# EAGLE design final (EAGLE 6.1)
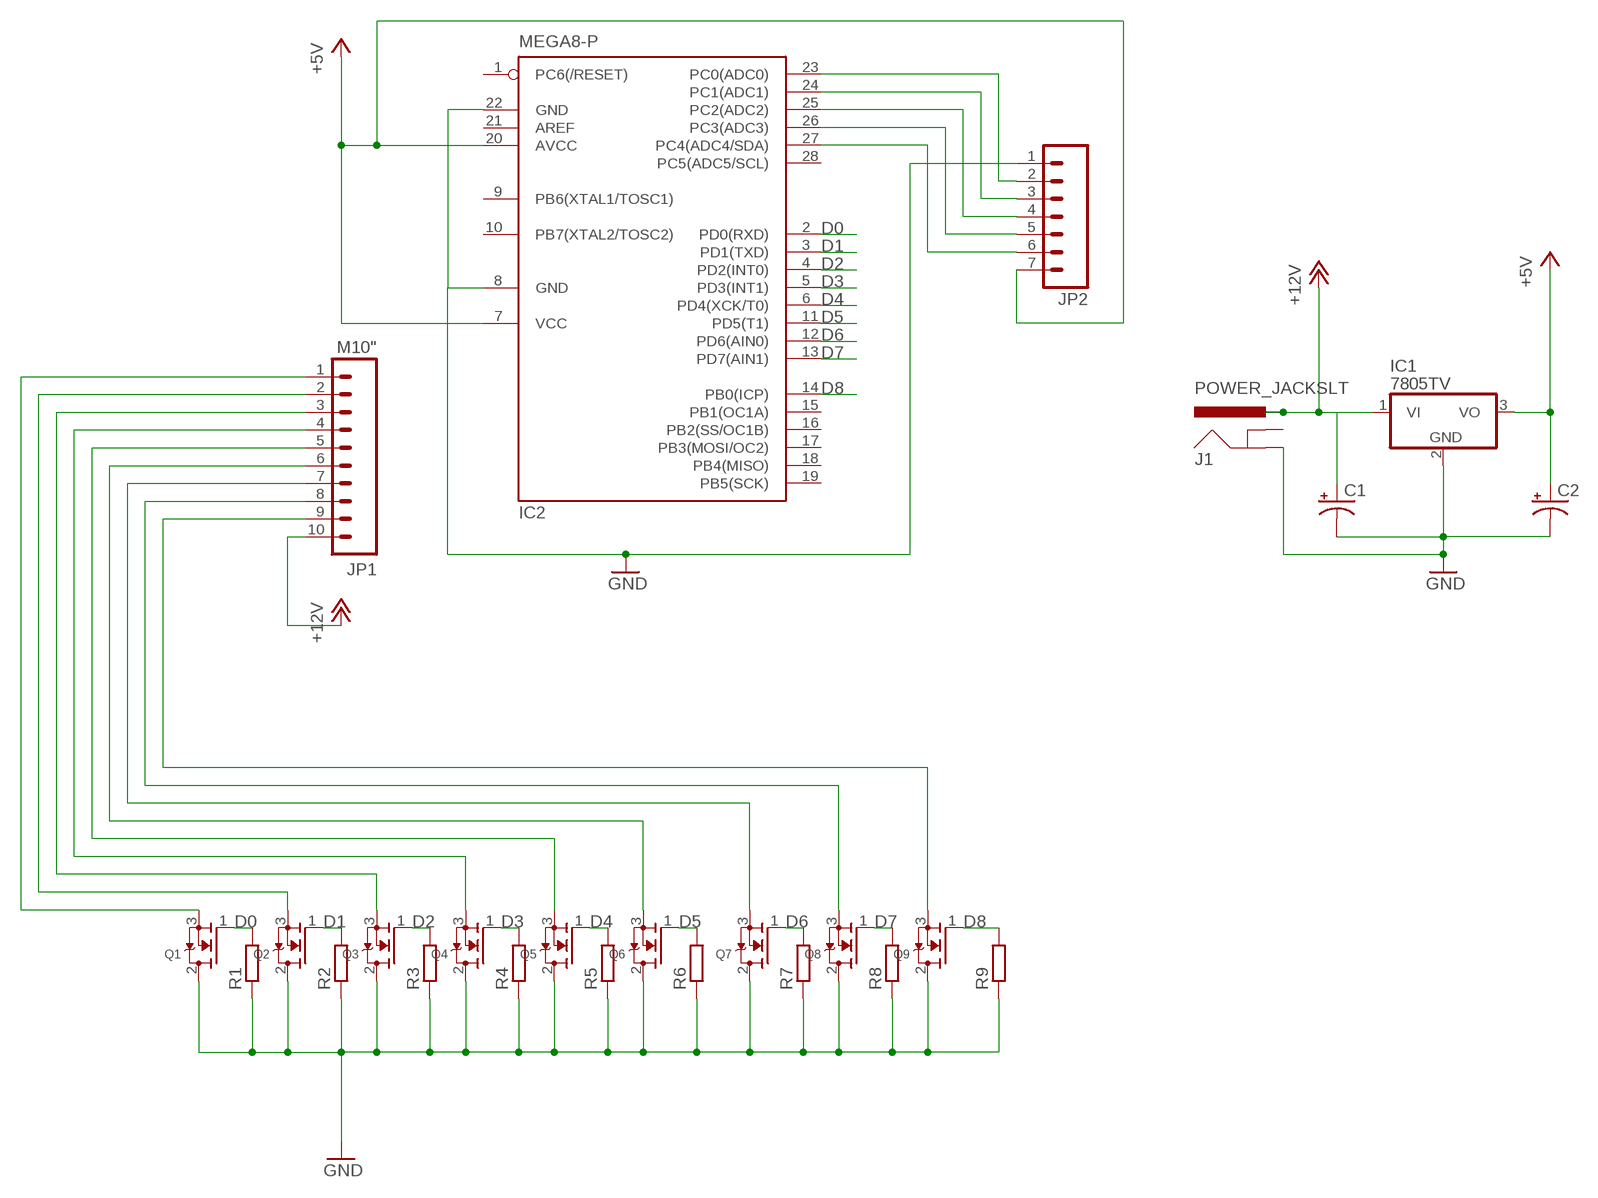
[diagram p0: schematic, sheet 1]

## Parts
C1  CAP_POLPTH1  [CPOL-RADIAL-100UF-25V]
C2  CAP_POLPTH1  [CPOL-RADIAL-100UF-25V]
IC1  7805TV  [TO220V]
IC2  MEGA8-P  [DIL28-3]
J1  POWER_JACKSLT  [POWER_JACK_SLOT]
JP1  M10"  [1X10]
JP2  M07  [1X07]
Q1  MOSFET-NGDS_TO220V  [TO220V]
Q2  MOSFET-NGDS_TO220V  [TO220V]
Q3  MOSFET-NGDS_TO220V  [TO220V]
Q4  MOSFET-NGDS_TO220V  [TO220V]
Q5  MOSFET-NGDS_TO220V  [TO220V]
Q6  MOSFET-NGDS_TO220V  [TO220V]
Q7  MOSFET-NGDS_TO220V  [TO220V]
Q8  MOSFET-NGDS_TO220V  [TO220V]
Q9  MOSFET-NGDS_TO220V  [TO220V]
R1  R-EU_M0805  [M0805]
R2  R-EU_M0805  [M0805]
R3  R-EU_M0805  [M0805]
R4  R-EU_M0805  [M0805]
R5  R-EU_M0805  [M0805]
R6  R-EU_M0805  [M0805]
R7  R-EU_M0805  [M0805]
R8  R-EU_M0805  [M0805]
R9  R-EU_M0805  [M0805]

## Nets
+5V: C2.1(+) IC1.3(VO) IC2.7(VCC) IC2.20(AVCC) JP2.7
+12V: C1.1(+) IC1.1(VI) J1.PWR JP1.10
D0: IC2.2(PD0(RXD)) Q1.1(G) R1.2
D1: IC2.3(PD1(TXD)) Q2.1(G) R2.2
D2: IC2.4(PD2(INT0)) Q3.1(G) R3.2
D3: IC2.5(PD3(INT1)) Q4.1(G) R4.2
D4: IC2.6(PD4(XCK/T0)) Q5.1(G) R5.2
D5: IC2.11(PD5(T1)) Q6.1(G) R6.2
D6: IC2.12(PD6(AIN0)) Q7.1(G) R7.2
D7: IC2.13(PD7(AIN1)) Q8.1(G) R8.2
D8: IC2.14(PB0(ICP)) Q9.1(G) R9.2
GND: C1.2(-) C2.2(-) IC1.2(GND) IC2.8(GND) IC2.22(GND) J1.GND@2(GND) JP2.1 Q1.2(D) Q2.2(D) Q3.2(D) Q4.2(D) Q5.2(D) Q6.2(D) Q7.2(D) Q8.2(D) Q9.2(D) R1.1 R2.1 R3.1 R4.1 R5.1 R6.1 R7.1 R8.1 R9.1
N$1: JP1.1 Q1.3(S)
N$2: JP1.2 Q2.3(S)
N$3: JP1.3 Q3.3(S)
N$4: IC2.27(PC4(ADC4/SDA)) JP2.6
N$5: IC2.23(PC0(ADC0)) JP2.2
N$6: IC2.24(PC1(ADC1)) JP2.3
N$7: IC2.25(PC2(ADC2)) JP2.4
N$8: IC2.26(PC3(ADC3)) JP2.5
N$9: JP1.4 Q4.3(S)
N$10: JP1.5 Q5.3(S)
N$11: JP1.6 Q6.3(S)
N$12: JP1.7 Q7.3(S)
N$13: JP1.8 Q8.3(S)
N$14: JP1.9 Q9.3(S)
Unconnected: IC2.1(PC6(/RESET)) IC2.9(PB6(XTAL1/TOSC1)) IC2.10(PB7(XTAL2/TOSC2)) IC2.15(PB1(OC1A)) IC2.16(PB2(SS/OC1B)) IC2.17(PB3(MOSI/OC2)) IC2.18(PB4(MISO)) IC2.19(PB5(SCK)) IC2.21(AREF) IC2.28(PC5(ADC5/SCL)) J1.GND@1(GNDBREAK)

## Library data of the parts
C1 C2 = SparkFun:CAP_POL: Capacitor Polarized These are standard SMD and PTH capacitors. Normally 10uF, 47uF, and 100uF in electrolytic and tantalum varieties. Always verify the external diameter of the through hole cap, it varies with capacity, voltage, and manufacturer. The EIA devices should be standard.
IC1 = linear:78*: Positive VOLTAGE REGULATOR Source: http://cache.national.com/ds/LM/LM78L05.pdf http://www.fairchildsemi.com/ds/LM/LM7805.pdf
IC2 = atmel:MEGA8-P: MICROCONTROLLER 8 Kbytes FLASH, 1 kbytes SRAM, 512 bytes EEPROM, USART, 4-channel 10 bit ADC, 2-channel 8 bit ADC Pin compatible with Atmega48, ATMega88, ATMega168 Source: avr.lbr; OC_FARNELL: unknown; OC_NEWARK: unknown
J1 = SparkFun:POWER_JACK: Power Jack This is the standard 5.5mm barrel jack for power. The PTH is the most common, proven, reliable, footprint. All others are experimental. The Slot footprint only works if the mill layer is transmitted to the PCB fab house so be warned. Spark Fun Electronics SKU : PRT-00119. Mating wall wart : TOL-00298 (and others)
JP1 = SparkFun:M10: Header 10 Standard 10-pin 0.1" header. Use with straight break away headers (SKU : PRT-00116), right angle break away headers (PRT-00553), swiss pins (PRT-00743), machine pins (PRT-00117), and female headers (PRT-00115).
JP2 = SparkFun:M07: Header 7 Standard 7-pin 0.1" header. Use with straight break away headers (SKU : PRT-00116), right angle break away headers (PRT-00553), swiss pins (PRT-00743), machine pins (PRT-00117), and female headers (PRT-00115). NOTES ON THE VARIANTS LOCK and LOCK_LONGPADS... This footprint was designed to help hold the alignment of a through-hole component (i.e. 7-pin header) while soldering it into place. You may notice that each hole has been shifted either up or down by 0.005 of an inch from it's more standard position (which is usually a perfectly straight line). This slight alteration caused the pins (the squares in the middle) to touch the edges of the holes. Because they are alternating, it causes a "brace" to hold the header in place. 0.005 has proven to be the perfect amount of "off-center" position when using our standard breakaway headers. Although looks a little odd when you look at the bare footprint, once you have a header in there, the alteration is very hard to notice. Also, if you push a header all the way into place, it is covered up entirely on the bottom side. This idea of altering the position of holes to aid alignment will be further integrated into the Sparkfun Library for other footprints. It can help hold any component with 3 or more connection pins.
Q1-Q9 = adafruit:MOSFET-N: N-Channel Mosfet 2N7002E - 60V 260mA SOT23 [Digikey: 2N7002ET1GOSTR-ND] - REEL BSH103 - 30V 850mA SOT23 [Digikey: 568-5013-1-ND]
R1-R9 = rcl:R-EU_: RESISTOR, European symbol

## Board
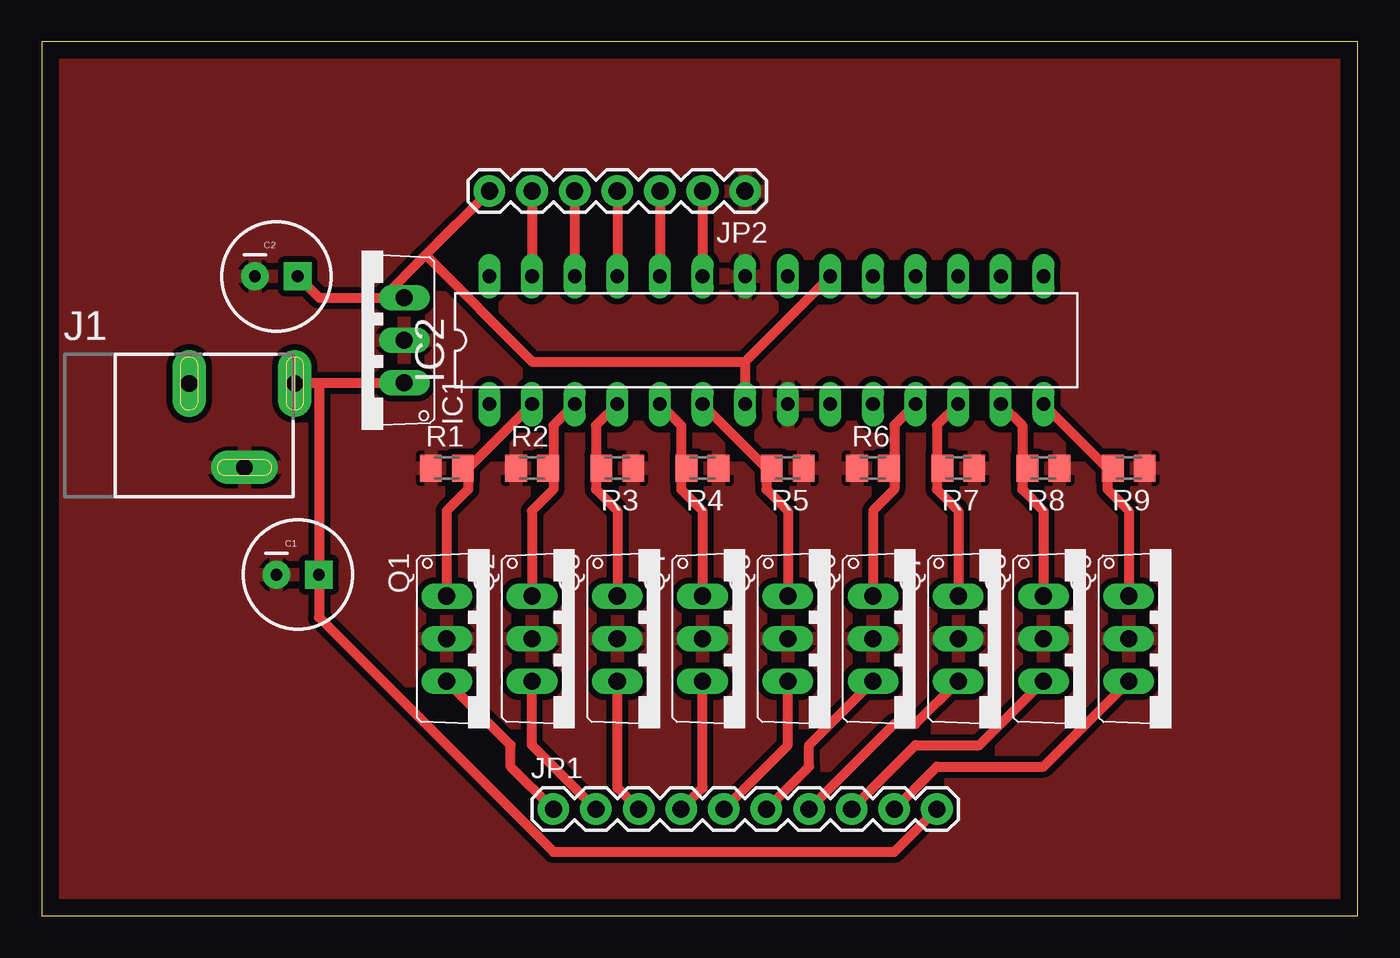
[diagram p1: board, top side]

Size 78.41 x 52.06 mm. Coordinates in mm from the lower left corner, seen from the top.
Outline: 0,0 78.41,0 78.41,52.06 0,52.06 0,0
Copper layers (1*16): Top 0.035mm / dielectric 1.5mm / Bottom 0.035mm
Design rules: minimum track width 24mil, minimum drill 24mil, track to track 14mil, track to pad 14mil, pad to pad 14mil, via to via 14mil, smd to smd 14mil, copper to edge 40mil, drill to drill 15mil, minimum pad ring 10mil, minimum via ring 8mil, stop-mask expansion 4mil, vias tented up to drill 0mil, thermal gap 10mil

### Footprints (pad centres in the part's own frame; a part is rotated, then mirrored left to right if it is on the bottom)
CPOL-RADIAL-100UF-25V = drill 0.7 pad 1.651 square: 1 1.27,0 | drill 0.7 pad 1.651: 2 -1.27,0
TO220V = drill 1.016 long: 1 -2.54,-2.54; 2 0,-2.54; 3 2.54,-2.54
DIL28-3 = drill 0.813 long: 1 -16.51,-3.81; 2 -13.97,-3.81; 3 -11.43,-3.81; 4 -8.89,-3.81; 5 -6.35,-3.81; 6 -3.81,-3.81; 7 -1.27,-3.81; 8 1.27,-3.81; 9 3.81,-3.81; 10 6.35,-3.81; 11 8.89,-3.81; 12 11.43,-3.81; 13 13.97,-3.81; 14 16.51,-3.81; 15 16.51,3.81; 16 13.97,3.81; 17 11.43,3.81; 18 8.89,3.81; 19 6.35,3.81; 20 3.81,3.81; 21 1.27,3.81; 22 -1.27,3.81; 23 -3.81,3.81; 24 -6.35,3.81; 25 -8.89,3.81; 26 -11.43,3.81; 27 -13.97,3.81; 28 -16.51,3.81
POWER_JACK_SLOT = drill 1 pad 2 long: GND@1 2.58,7.5; GND@2 7.58,10.8; PWR 2.58,13.8
1X10 = drill 1.016 pad 1.88: 1 0,0; 2 2.54,0; 3 5.08,0; 4 7.62,0; 5 10.16,0; 6 12.7,0; 7 15.24,0; 8 17.78,0; 9 20.32,0; 10 22.86,0
1X07 = drill 1.016 pad 1.88: 1 0,0; 2 2.54,0; 3 5.08,0; 4 7.62,0; 5 10.16,0; 6 12.7,0; 7 15.24,0
M0805 = smd 1.3 x 1.6: 1 -0.95,0; 2 0.95,0

### Placement (x,y rotation side)
C1  15.24,20.32 0 top
C2  13.97,38.1 0 top
IC1  19.05,34.29 90 top
IC2  43.18,34.29 0 top
J1  1.27,34.29 270 top
JP1  30.48,6.35 0 top
JP2  41.91,43.18 180 top
Q1  26.67,16.51 270 top
Q2  31.75,16.51 270 top
Q3  36.83,16.51 270 top
Q4  41.91,16.51 270 top
Q5  46.99,16.51 270 top
Q6  52.07,16.51 270 top
Q7  57.15,16.51 270 top
Q8  62.23,16.51 270 top
Q9  67.31,16.51 270 top
R1  24.13,26.67 0 top
R2  29.21,26.67 0 top
R3  34.29,26.67 180 top
R4  39.37,26.67 180 top
R5  44.45,26.67 180 top
R6  49.53,26.67 0 top
R7  54.61,26.67 180 top
R8  59.69,26.67 180 top
R9  64.77,26.67 180 top

### Tracks (layer width: path | path; a pad name or v marks a point on that pad's centre or on a via)
+5V
  Top 0.61: 41.91,33.02 IC2.7 | IC2.20 41.91,33.02 | 20.32,36.83 16.51,36.83 C2.1 | 20.32,36.83 22.86,39.37 | 22.86,39.37 JP2.7 | 20.32,36.83 IC1.3 | 41.91,33.02 29.21,33.02 22.86,39.37
+12V
  Top 0.61: 16.51,31.75 15.24,31.75 J1.PWR | 16.51,31.75 IC1.1 | 16.51,31.75 C1.1 16.51,17.78 30.48,3.81 50.8,3.81 JP1.10
D0
  Top 0.61: IC2.2 25.4,26.67 | Q1.1 24.13,24.13 25.4,25.4 25.4,26.67 | 25.4,26.67 R1.2
D1
  Top 0.61: 30.48,26.67 30.48,29.21 IC2.3 | Q2.1 29.21,24.13 30.48,25.4 30.48,26.67 | 30.48,26.67 R2.2
D2
  Top 0.61: 33.02,26.67 33.02,29.21 IC2.4 | Q3.1 34.29,24.13 33.02,25.4 33.02,26.67 | 33.02,26.67 R3.2
D3
  Top 0.61: 38.1,26.67 38.1,29.21 IC2.5 | Q4.1 39.37,24.13 38.1,25.4 38.1,26.67 | 38.1,26.67 R4.2
D4
  Top 0.61: IC2.6 43.18,26.67 | Q5.1 44.45,24.13 43.18,25.4 43.18,26.67 | 43.18,26.67 R5.2
D5
  Top 0.61: 50.8,26.67 50.8,29.21 IC2.11 | Q6.1 49.53,24.13 50.8,25.4 50.8,26.67 | 50.8,26.67 R6.2
D6
  Top 0.61: 53.34,26.67 53.34,29.21 IC2.12 | Q7.1 54.61,24.13 53.34,25.4 53.34,26.67 | 53.34,26.67 R7.2
D7
  Top 0.61: 58.42,26.67 58.42,29.21 IC2.13 | Q8.1 59.69,24.13 58.42,25.4 58.42,26.67 | 58.42,26.67 R8.2
D8
  Top 0.61: IC2.14 63.5,26.67 | Q9.1 64.77,24.13 63.5,25.4 63.5,26.67 | 63.5,26.67 R9.2
GND
  pour Top: 0,0 81.28,-2.54 77.47,53.34 -8.89,55.88
N$1
  Top 0.61: Q1.3 27.94,10.16 27.94,8.89 JP1.1
N$2
  Top 0.61: Q2.3 29.21,10.16 JP1.2
N$3
  Top 0.61: Q3.3 34.29,7.62 JP1.3
N$4
  Top 0.61: JP2.6 IC2.27
N$5
  Top 0.61: JP2.2 IC2.23
N$6
  Top 0.61: JP2.3 IC2.24
N$7
  Top 0.61: JP2.4 IC2.25
N$8
  Top 0.61: JP2.5 IC2.26
N$9
  Top 0.61: Q4.3 39.37,7.62 JP1.4
N$10
  Top 0.61: Q5.3 44.45,10.16 JP1.5
N$11
  Top 0.61: Q6.3 45.72,10.16 45.72,8.89 JP1.6
N$12
  Top 0.61: Q7.3 52.07,11.43 50.8,11.43 JP1.7
N$13
  Top 0.61: Q8.3 55.88,10.16 52.07,10.16 JP1.8
N$14
  Top 0.61: Q9.3 59.69,8.89 53.34,8.89 JP1.9